# EAGLE schematic quadESP_DevKit_v1_panelized (EAGLE 9.6.2)
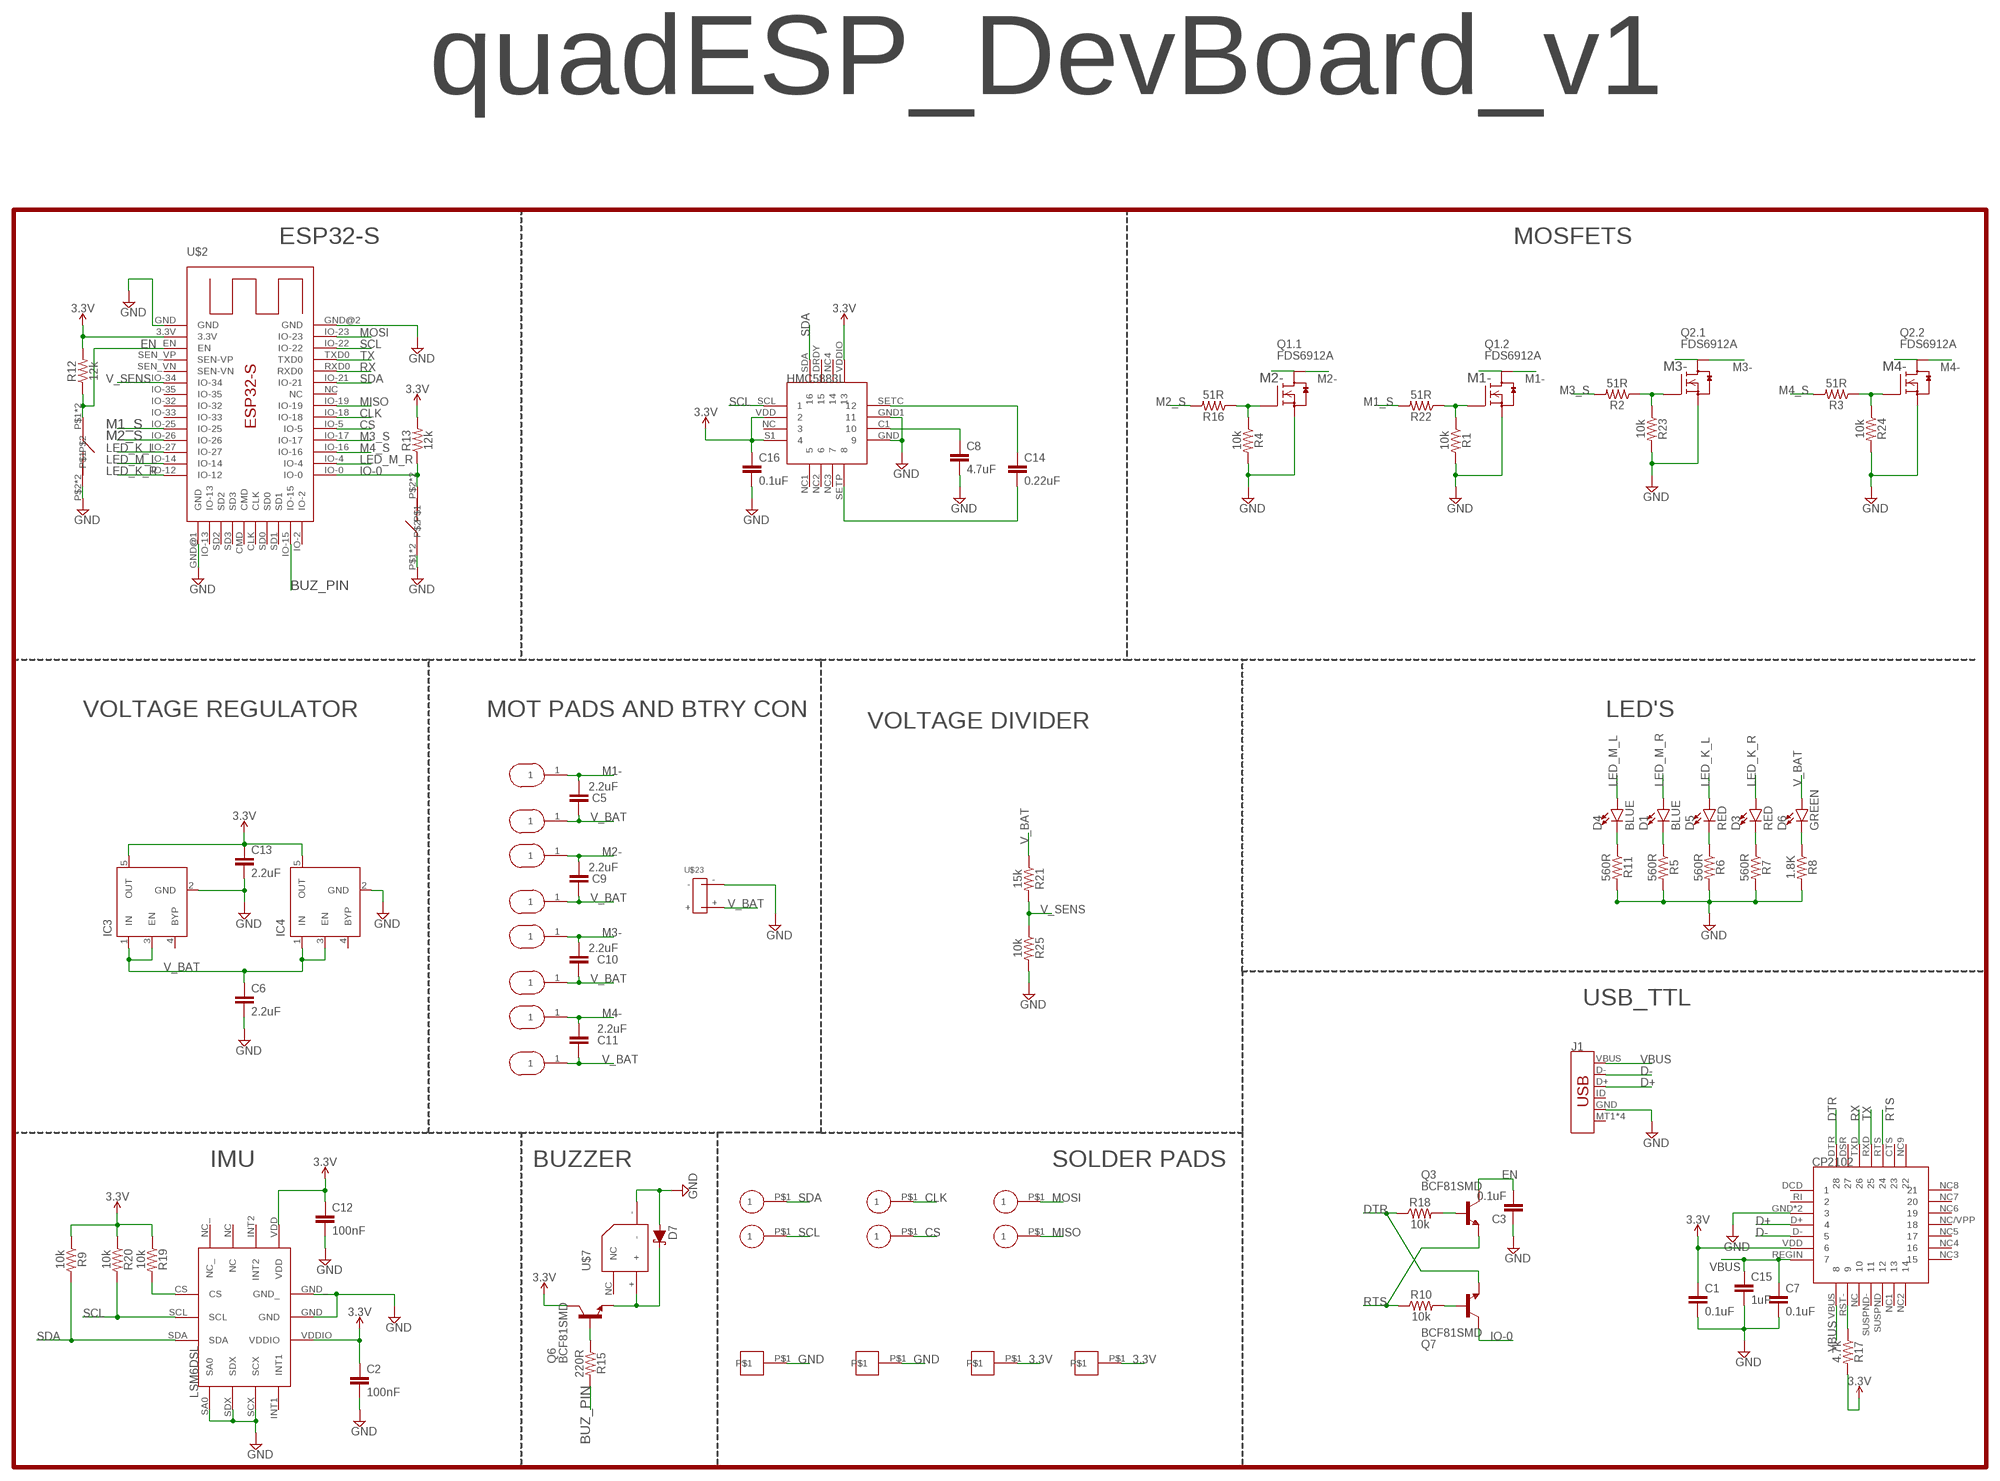
[diagram p0: schematic, sheet 1]

## Parts
C1  0.1uF  2.2UF-0603-10V-20%  [0603]
C2  100nF  2.2UF-0603-10V-20%  [0603]
C3  0.1uF  2.2UF-0603-10V-20%  [0603]
C5  2.2uF  2.2UF-0603-10V-20%  [0603]
C6  2.2uF  2.2UF-0603-10V-20%  [0603]
C7  0.1uF  2.2UF-0603-10V-20%  [0603]
C8  4.7uF  2.2UF-0603-10V-20%  [0603]
C9  2.2uF  2.2UF-0603-10V-20%  [0603]
C10  2.2uF  2.2UF-0603-10V-20%  [0603]
C11  2.2uF  2.2UF-0603-10V-20%  [0603]
C12  100nF  2.2UF-0603-10V-20%  [0603]
C13  2.2uF  2.2UF-0603-10V-20%  [0603]
C14  0.22uF  2.2UF-0603-10V-20%  [0603]
C15  1uF  2.2UF-0603-10V-20%  [0603]
C16  0.1uF  2.2UF-0603-10V-20%  [0603]
D1  BLUE  LED-BLUE0603  [LED-0603]
D3  RED  LED-RED0603  [LED-0603]
D4  BLUE  LED-BLUE0603  [LED-0603]
D5  RED  LED-RED0603  [LED-0603]
D6  GREEN  LED-GREEN0603  [LED-0603]
D7  120mA/40V/370mV  DIODE-SCHOTTKY-RB751S40  [SOD-523]
IC3  MIC5219XX  [SOT23-5]
IC4  MIC5219XX  [SOT23-5]
J1  USB_MICRO-B_SMT  [USB-MICROB]
Q1  FDS6912A  [SO-8]
Q2  FDS6912A  [SO-8]
Q3  BCF81SMD  [SOT23-BEC]
Q6  BCF81SMD  [SOT23-BEC]
Q7  BCF81SMD  [SOT23-BEC]
R1  10k  12KOHM-0603-1/10W-1%  [0603]
R2  51R  12KOHM-0603-1/10W-1%  [0603]
R3  51R  12KOHM-0603-1/10W-1%  [0603]
R4  10k  12KOHM-0603-1/10W-1%  [0603]
R5  560R  12KOHM-0603-1/10W-1%  [0603]
R6  560R  12KOHM-0603-1/10W-1%  [0603]
R7  560R  12KOHM-0603-1/10W-1%  [0603]
R8  1.8K  12KOHM-0603-1/10W-1%  [0603]
R9  10k  12KOHM-0603-1/10W-1%  [0603]
R10  10k  12KOHM-0603-1/10W-1%  [0603]
R11  560R  12KOHM-0603-1/10W-1%  [0603]
R12  12k  12KOHM-0603-1/10W-1%  [0603]
R13  12k  12KOHM-0603-1/10W-1%  [0603]
R15  220R  12KOHM-0603-1/10W-1%  [0603]
R16  51R  12KOHM-0603-1/10W-1%  [0603]
R17  4.7k  12KOHM-0603-1/10W-1%  [0603]
R18  10k  12KOHM-0603-1/10W-1%  [0603]
R19  10k  12KOHM-0603-1/10W-1%  [0603]
R20  10k  12KOHM-0603-1/10W-1%  [0603]
R21  15k  12KOHM-0603-1/10W-1%  [0603]
R22  51R  12KOHM-0603-1/10W-1%  [0603]
R23  10k  12KOHM-0603-1/10W-1%  [0603]
R24  10k  12KOHM-0603-1/10W-1%  [0603]
R25  10k  12KOHM-0603-1/10W-1%  [0603]
U$1  CP2102_SERIAL_TTL  [CP2102_SERIAL_TTL]
U$2  ESP32-S  [ESP32-S]
U$3  TACTILE_SWITCH_4X3X2  [TACTILE_SWITCH_4X3X2]
U$4  SOLDER_PAD_1.2_CIRCLE  [SOLDER_PAD_1.2_CIRCLE]
U$6  LSM6DSL_6DOF  [LSM6DSL_6DOF]
U$7  PASIVE_BUZZER_5MM_X_5MM_20MM  [PASIVE_BUZZER_5MM_X_5MM_20MM]
U$8  1.5X2.5_PAD  [1.5X2.5_PAD]
U$9  1.5X2.5_PAD  [1.5X2.5_PAD]
U$10  1.5X2.5_PAD  [1.5X2.5_PAD]
U$11  1.5X2.5_PAD  [1.5X2.5_PAD]
U$12  1.5X2.5_PAD  [1.5X2.5_PAD]
U$13  1.5X2.5_PAD  [1.5X2.5_PAD]
U$15  SOLDER_PAD_1.2_CIRCLE  [SOLDER_PAD_1.2_CIRCLE]
U$18  HMC5883L  [HMC5883L]
U$19  SOLDER_PAD_1.2_SQUARE  [SOLDER_PAD_1.2_SQUARE]
U$23  2X_SOLDER_PAD  [2X_SOLDER_PAD]
U$24  TACTILE_SWITCH_4X3X2  [TACTILE_SWITCH_4X3X2]
U$25  SOLDER_PAD_1.2_CIRCLE  [SOLDER_PAD_1.2_CIRCLE]
U$26  SOLDER_PAD_1.2_SQUARE  [SOLDER_PAD_1.2_SQUARE]
U$28  SOLDER_PAD_1.2_SQUARE  [SOLDER_PAD_1.2_SQUARE]
U$30  SOLDER_PAD_1.2_SQUARE  [SOLDER_PAD_1.2_SQUARE]
U$31  1.5X2.5_PAD  [1.5X2.5_PAD]
U$32  SOLDER_PAD_1.2_CIRCLE  [SOLDER_PAD_1.2_CIRCLE]
U$33  SOLDER_PAD_1.2_CIRCLE  [SOLDER_PAD_1.2_CIRCLE]
U$34  SOLDER_PAD_1.2_CIRCLE  [SOLDER_PAD_1.2_CIRCLE]
U$36  1.5X2.5_PAD  [1.5X2.5_PAD]

## Nets
3.3V: C1.1 C2.1 C12.1 C13.1 C16.1 IC3.5(OUT) IC4.5(OUT) Q6.C R9.1 R12.2 R13.2 R17.2 R19.1 R20.1 U$1.VDD U$2.3.3V U$6.VDD U$6.VDDIO U$18.S1 U$18.VDD U$18.VDDIO U$28.P$1 U$30.P$1
BUZ_PIN: R15.2 U$2.IO-15
CLK: U$2.IO-18 U$25.P$1
CS: U$2.IO-5 U$32.P$1
D+: J1.D+ U$1.D+
D-: J1.D- U$1.D-
DTR: Q7.E R18.1 U$1.DTR
EN: C3.2 Q3.C R12.1 U$2.EN U$3.P$1 U$3.P$4
GND: C1.2 C2.2 C3.1 C6.2 C7.2 C8.2 C12.2 C13.2 C15.2 C16.2 D7.A IC3.2(GND) IC4.2(GND) J1.GND Q1.1(.2:S) Q1.3(.1:S) Q2.1(.2:S) Q2.3(.1:S) R1.2 R4.2 R5.2 R6.2 R7.2 R8.2 R11.2 R23.2 R24.2 R25.2 U$1.GND U$1.GND1 U$2.GND U$2.GND@1(GND) U$2.GND@2(GND) U$3.P$2 U$3.P$3 U$6.GND U$6.GND_ U$6.SA0 U$6.SCX U$6.SDX U$7.- U$18.GND U$18.GND1 U$19.P$1 U$23.- U$24.P$1 U$24.P$4 U$26.P$1
IO-0: Q7.C R13.1 U$2.IO-0 U$24.P$2 U$24.P$3
LED_K_L: D5.A U$2.IO-27
LED_K_R: D3.A U$2.IO-12
LED_M_L: D4.A U$2.IO-14
LED_M_R: D1.A U$2.IO-4
M1-: C5.2 Q1.7(.2:D) Q1.8(.2:D) U$31.1
M1_S: R22.2 U$2.IO-25
M2-: C9.2 Q1.5(.1:D) Q1.6(.1:D) U$36.1
M2_S: R16.2 U$2.IO-26
M3-: C10.2 Q2.5(.1:D) Q2.6(.1:D) U$9.1
M3_S: R2.2 U$2.IO-17
M4-: C11.1 Q2.7(.2:D) Q2.8(.2:D) U$11.1
M4_S: R3.2 U$2.IO-16
MISO: U$2.IO-19 U$34.P$1
MOSI: U$2.IO-23 U$33.P$1
N$1: D1.C R5.1
N$2: D5.C R6.1
N$3: D3.C R7.1
N$4: D6.C R8.1
N$5: D4.C R11.1
N$6: Q1.4(.1:G) R4.1 R16.1
N$7: Q1.2(.2:G) R1.1 R22.1
N$8: Q2.4(.1:G) R2.1 R23.1
N$9: Q2.2(.2:G) R3.1 R24.1
N$10: Q6.B R15.1
N$11: R17.1 U$1.RST-
N$12: D7.C Q6.E U$7.+
N$13: Q3.B R18.2
N$15: R19.2 U$6.CS
N$17: Q7.B R10.2
N$22: C14.2 U$18.SETP
N$26: C8.1 U$18.C1
N$27: C14.1 U$18.SETC
RTS: Q3.E R10.1 U$1.RTS
RX: U$1.TXD U$2.RXD0
SCL: R20.2 U$2.IO-22 U$6.SCL U$15.P$1 U$18.SCL
SDA: R9.2 U$2.IO-21 U$4.P$1 U$6.SDA U$18.SDA
TX: U$1.RXD U$2.TXD0
V_BAT: C5.1 C6.1 C9.1 C10.1 C11.2 D6.A IC3.1(IN) IC3.3(EN) IC4.1(IN) IC4.3(EN) R21.1 U$8.1 U$10.1 U$12.1 U$13.1 U$23.+
V_SENS: R21.2 R25.1 U$2.IO-34
VBUS: C7.1 C15.1 J1.VBUS U$1.REGIN U$1.VBUS
Unconnected: IC3.4(BYP) IC4.4(BYP) J1.ID J1.MT1(SHIELD) J1.MT2(SHIELD) J1.P$1(SHIELD) J1.P$2(SHIELD) U$1.CTS U$1.DCD U$1.DSR U$1.NC U$1.NC1 U$1.NC2 U$1.NC3 U$1.NC4 U$1.NC5 U$1.NC6 U$1.NC7 U$1.NC8 U$1.NC9 U$1.NC/VPP U$1.RI U$1.SUSPND U$1.SUSPND- U$2.CLK U$2.CMD U$2.IO-2 U$2.IO-13 U$2.IO-32 U$2.IO-33 U$2.IO-35 U$2.NC U$2.SD0 U$2.SD1 U$2.SD2 U$2.SD3 U$2.SEN_VN(SEN-VN) U$2.SEN_VP(SEN-VP) U$6.INT1 U$6.INT2 U$6.NC U$6.NC_ U$7.NC U$18.DRDY U$18.NC U$18.NC1 U$18.NC2 U$18.NC3 U$18.NC4

## Notes on the sheet
- quadESP_DevBoard_v1
- ESP32-S | MOSFETS
- VOLTAGE REGULATOR | MOT PADS AND BTRY CON | LED'S
- VOLTAGE DIVIDER
- USB_TTL
- IMU | BUZZER | SOLDER PADS

## Library data of the parts
C1-C3 C7 C8 C12 C14-C16 = SparkFun-Capacitors:2.2UF: 2.2µF ceramic capacitors A capacitor is a passive two-terminal electrical component used to store electrical energy temporarily in an electric field.; PROD_ID: CAP-07888; VALUE: 2.2uF
C5 C6 C9-C11 C13 = SparkFun-Capacitors:2.2UF: 2.2µF ceramic capacitors A capacitor is a passive two-terminal electrical component used to store electrical energy temporarily in an electric field.; PROD_ID: CAP-07888
D1 D4 = SparkFun-LED:LED-BLUE: Blue SMD LED Used in manufacturing of various products at SparkFun Packages: 0603 - SMD 0603 package [Product Link] <http://www.digikey.com/product-detail/en/SMLE12BC7TT86/511-1589-2-ND/1641808> 1206 - SMD1206 package [Product Link] <http://www.digikey.com/product-detail/en/lite-on-inc/LTST-C150TBKT/160-1643-1-ND/573584> SparkFun Products: ESP8266 Thing-Dev Board <https://www.sparkfun.com/products/13711> RedBoard <https://www.sparkfun.com/products/12757>; PROD_ID: DIO-08575
D3 D5 = SparkFun-LED:LED-RED: Red SMD LED Used in manufacturing of most products at SparkFun Packages: 0603 - SMD 0603 package [Product Link] <http://docs.avagotech.com/docs/AV02-0551EN> 0603 SMART - SMD 0603 SMART package ( more efficient and expensive)[Product Link] <http://www.osram-os.com/Graphics/XPic2/00077099_0.pdf> 1206 - SMD1206 package [Product Link] <https://www.sparkfun.com/datasheets/DevTools/LilyPad/Q150OVS4.pdff> SparkFun Products: Pro Mini 328 -5V <https://www.sparkfun.com/products/821> RedBoard <https://www.sparkfun.com/products/12757> IOIO-OTG <https://www.sparkfun.com/products/13613>; PROD_ID: DIO-00819
D6 = SparkFun-LED:LED-GREEN: Green SMD LED Used in manufacturing of various products at SparkFun Packages: 0603 - SMD 0603 package [Product Link] <http://www.futureelectronics.com/en/technologies/semiconductors/optoelectronics/leds/Pages/9894312-LTST-C190GKT.aspx?CrossPart=HSMG-C190&IM=0> LilyPad 1206 - SMD1206 LilyPad package [Product Link] <http://www.futureelectronics.com/en/Technologies/Product.aspx?ProductID=IN150NGHARVATEKCORPORATION2049943&IM=0> 1206 - SMD1206 package [Product Link] <http://www.futureelectronics.com/en/technologies/semiconductors/optoelectronics/leds/Pages/8315665-LTST-C150KGKT.aspx?IM=0> 1206 Bottom Mount -SMD 1206 Bottom Mount [Product Link] <http://www.digikey.com/product-detail/en/lite-on-inc/LTST-C230KGKT/160-1456-1-ND/386854> SparkFun Products: Pro Mini 328 -5V <https://www.sparkfun.com/products/821> RedBoard <https://www.sparkfun.com/products/12757> MP3 Trigger <https://www.sparkfun.com/products/13720> Makey Makey <https://www.sparkfun.com/products/11076>; PROD_ID: DIO-00821
D7 = SparkFun-DiscreteSemi:DIODE-SCHOTTKY: Schottky diode A Schottky diode is a semiconductor diode which has a low forward voltage drop and a very fast switching action.; PROD_ID: DIO-11018
IC3 IC4 = v-reg-micrel:MIC5219XX: VOLTAGE REGULATOR; OC_FARNELL: unknown; OC_NEWARK: unknown
J1 = SparkFun-Connectors:USB_MICRO-B: USB Type Micro-B Connector Male/female and PTH/SMT variants SparkFun Products: SparkFun microB USB Breakout <https://www.sparkfun.com/products/12035> SparkFun USB microB Plug Breakout <https://www.sparkfun.com/products/10031> SparkFun ESP8266 Thing <https://www.sparkfun.com/products/13231>; PROD_ID: CONN-09505; SF_ID: PRT-08533
Q1 Q2 = m-pad-2.1:FDS6912A: Fairchild's FDS6912A Dual N-Channel Logic Level PowerTrench MOSFET General Description: These N-Channel Logic Level MOSFETs are produced using Fairchild Semiconductor's advanced PowerTrench process that has been especially tailored to minimize the on-state resistance and yet maintain superior switching performance. These devices are well suited for low voltage and battery powered applications where low in-line power loss and fast switching are required. Features: 6 A, 30 V. RDS(ON) = 28 mOhm @ VGS = 10 V RDS(ON) = 35 mOhm @ VGS = 4.5 V Fast switching speed Low gate charge High performance trench technology for extremely low RDS(ON) High power and current handling capability Please send any comments to: messi@users.sourceforge.net
Q3 Q6 Q7 = transistor-npn:BCF81*: NPN Transistor
R1-R11 R15-R25 = SparkFun-Resistors:12KOHM: 12kΩ resistor A resistor is a passive two-terminal electrical component that implements electrical resistance as a circuit element. Resistors act to reduce current flow, and, at the same time, act to lower voltage levels within circuits. - Wikipedia; PROD_ID: RES-10327; VALUE: 12k
R12 R13 = SparkFun-Resistors:12KOHM: 12kΩ resistor A resistor is a passive two-terminal electrical component that implements electrical resistance as a circuit element. Resistors act to reduce current flow, and, at the same time, act to lower voltage levels within circuits. - Wikipedia; PROD_ID: RES-10327
U$1 = CP2102_SERIAL_TTLlbr:CP2102_SERIAL_TTL
U$2 = ESP32-S:ESP32-S: ESP32-S WIFI/BLUETOOTH MICRO CONTROLLER IC size 18mm x 25.5mm pad size 1.5mm x 0.9mm
U$3 U$24 = TACTILE_SWITCH_4X3X2:TACTILE_SWITCH_4X3X2
U$4 U$15 U$25 U$32-U$34 = SOLDER_PAD:SOLDER_PAD_1.2_CIRCLE
U$6 = LSM6DLS:LSM6DSL_6DOF
U$7 = PASIVE_BUZZER_5MM_X_5MM_20MM:PASIVE_BUZZER_5MM_X_5MM_20MM: PASIVE_BUZZER_5MM_X_5MM_20MM
U$8-U$13 U$31 U$36 = 1.5X2.5_PAD:1.5X2.5_PAD
U$18 = HMC5883L:HMC5883L
U$19 U$26 U$28 U$30 = SOLDER_PAD:SOLDER_PAD_1.2_SQUARE
U$23 = 2 X 3mm_round_solder_pads:2X_SOLDER_PAD